# EAGLE design Definitivo (EAGLE 8.0.1)
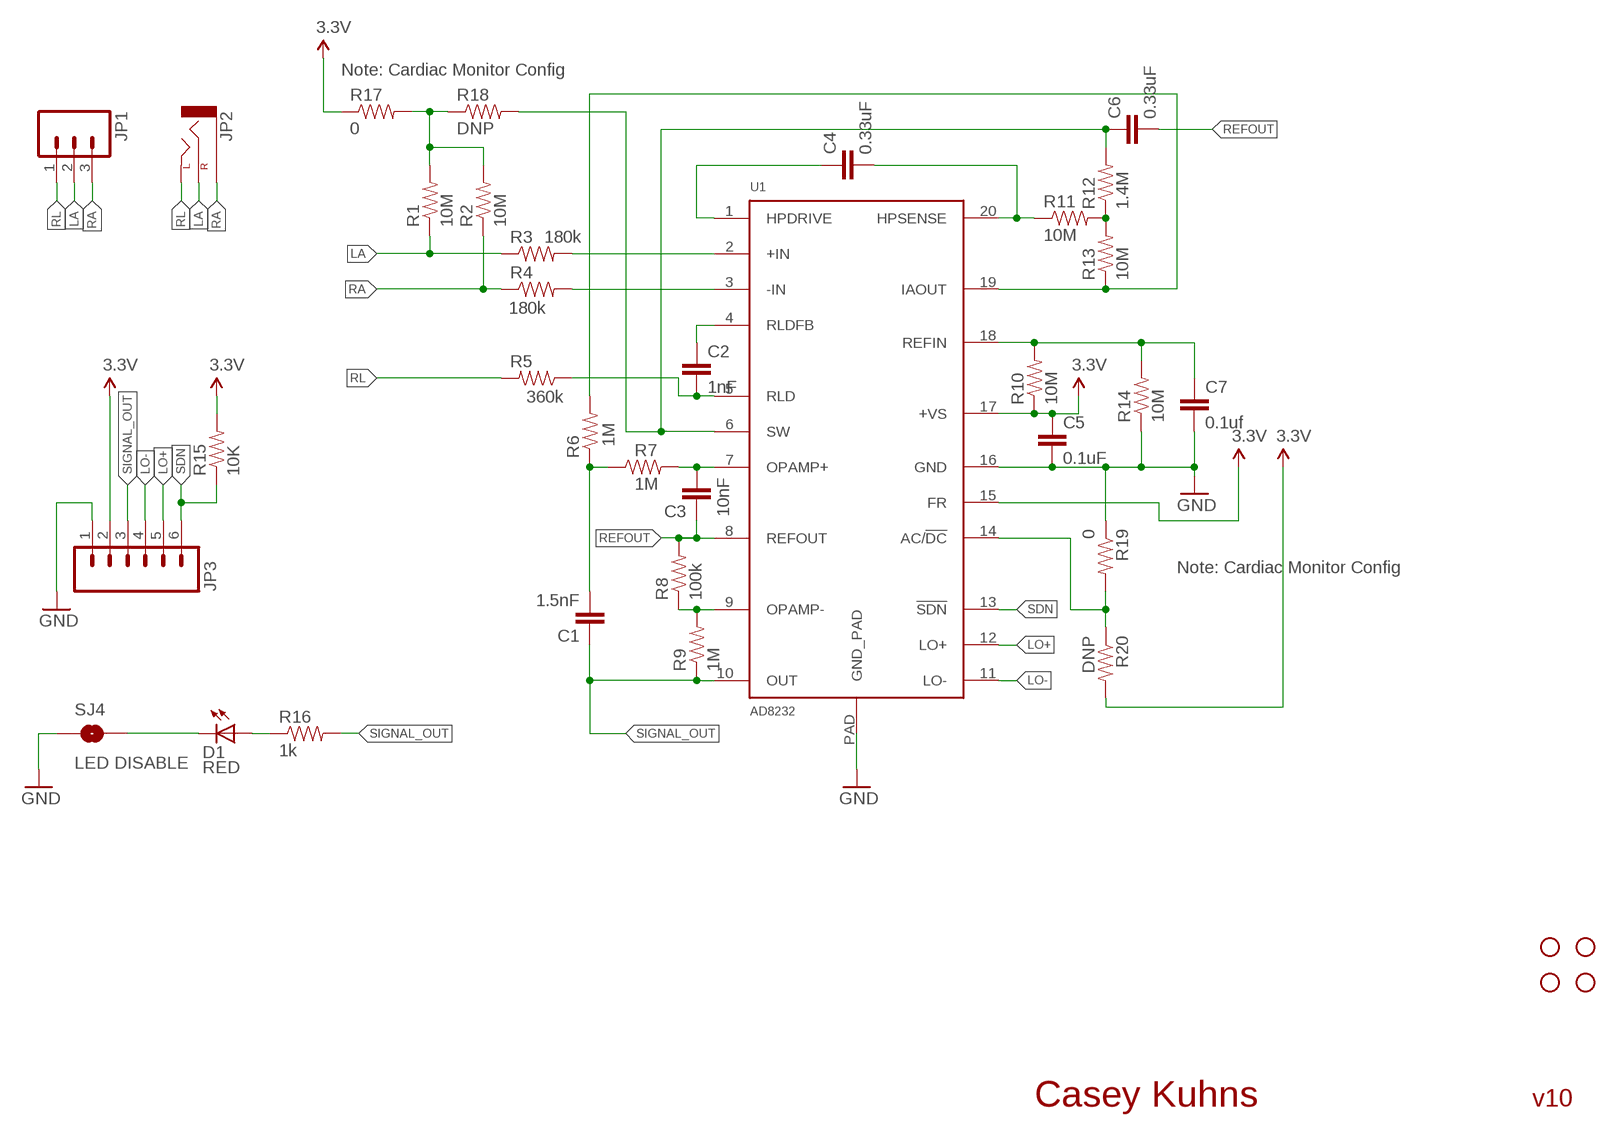
[diagram p0: schematic, sheet 1]

## Parts
C1  1.5nF  CAP0603-CAP  [0603-CAP]
C2  1nF  CAP0603-CAP  [0603-CAP]
C3  10nF  CAP0603-CAP  [0603-CAP]
C4  0.33uF  CAP0805  [0805]
C5  0.1uF  CAP0603-CAP  [0603-CAP]
C6  0.33uF  CAP0805  [0805]
C7  0.1uf  CAP0603-CAP  [0603-CAP]
D1  RED  LED-RED0603  [LED-0603]
JP1  M03PTH  [1X03]
JP2  AUDIO-JACKSMD2  [AUDIO-JACK-3.5MM-SMD]
JP3  M06SIP  [1X06]
R1  10M  RESISTOR0603-RES  [0603-RES]
R2  10M  RESISTOR0603-RES  [0603-RES]
R3  180k  RESISTOR0603-RES  [0603-RES]
R4  180k  RESISTOR0603-RES  [0603-RES]
R5  360k  RESISTOR0603-RES  [0603-RES]
R6  1M  RESISTOR0603-RES  [0603-RES]
R7  1M  RESISTOR0603-RES  [0603-RES]
R8  100k  RESISTOR0603-RES  [0603-RES]
R9  1M  RESISTOR0603-RES  [0603-RES]
R10  10M  RESISTOR0603-RES  [0603-RES]
R11  10M  RESISTOR0603-RES  [0603-RES]
R12  1.4M  RESISTOR0603-RES  [0603-RES]
R13  10M  RESISTOR0603-RES  [0603-RES]
R14  10M  RESISTOR0603-RES  [0603-RES]
R15  10K  10KOHM1/10W1%(0603)0603  [0603-RES]
R16  1k  1K-1%  [0603-RES]
R17  0  0OHM1/10W5%(0603)  [0603]
R18  DNP  0OHM1/10W5%(0603)  [0603]
R19  0  0OHM1/10W5%(0603)  [0603]
R20  DNP  0OHM1/10W5%(0603)  [0603]
SJ4  LED DISABLE  SOLDERJUMPERTRACE  [SJ_2S-TRACE]
STANDOFF1  STAND-OFF  [STAND-OFF]
STANDOFF2  STAND-OFF  [STAND-OFF]
STANDOFF3  STAND-OFF  [STAND-OFF]
STANDOFF4  STAND-OFF  [STAND-OFF]
U1  AD8232  [LFCSP_20]

## Nets
3.3V: C5.1 JP3.2 R10.1 R15.2 R17.1 R20.2 U1.15(FR) U1.17(+VS)
GND: C5.2 C7.2 JP3.1 R14.1 R19.1 SJ4.1 U1.16(GND) U1.PAD(GND_PAD)
LA: JP1.2 JP2.RING(RIGHT) R1.1 R3.1
LO+: JP3.5 U1.12(LO+)
LO-: JP3.4 U1.11(LO-)
N$1: R3.2 U1.2(+IN)
N$2: R4.2 U1.3(-IN)
N$3: C3.2 R7.2 U1.7(OPAMP+)
N$4: C4.2 R11.1 U1.20(HPSENSE)
N$5: C7.1 R10.2 R14.2 U1.18(REFIN)
N$6: D1.A R16.1
N$7: R8.1 R9.2 U1.9(OPAMP-)
N$8: R6.2 R13.1 U1.19(IAOUT)
N$9: C1.2 R6.1 R7.1
N$10: D1.C SJ4.2
N$11: R19.2 R20.1 U1.14(AC/!DC)
N$13: C4.1 U1.1(HPDRIVE)
N$14: R11.2 R12.1 R13.2
N$16: C6.1 R12.2 R18.2 U1.6(SW)
N$17: C2.1 U1.4(RLDFB)
N$18: C2.2 R5.1 U1.5(RLD)
N$20: R1.2 R2.2 R17.2 R18.1
RA: JP1.3 JP2.SLEEVE R2.1 R4.1
REFOUT: C3.1 C6.2 R8.2 U1.8(REFOUT)
RL: JP1.1 JP2.TIP(LEFT) R5.2
SDN: JP3.6 R15.1 U1.13(!SDN)
SIGNAL_OUT: C1.1 JP3.3 R9.1 R16.2 U1.10(OUT)

## Notes on the sheet
- Note: Cardiac Monitor Config
- Note: Cardiac Monitor Config
- Casey Kuhns | v10

## Library data of the parts
C1-C7 = SparkFun-Passives:CAP: Capacitor Standard 0603 ceramic capacitor, and 0.1" leaded capacitor.
D1 = SparkFun-LED:LED-RED: Assorted Red LEDs LilyPad 1206- DIO-09912 1206- DIO-00809 0603- DIO-00819; PROD_ID: DIO-00819
JP1 = SparkFun-Connectors:M03: Header 3 Standard 3-pin 0.1" header. Use with straight break away headers (SKU : PRT-00116), right angle break away headers (PRT-00553), swiss pins (PRT-00743), machine pins (PRT-00117), and female headers (PRT-00115). Molex polarized connector foot print use with SKU : PRT-08232 with associated crimp pins and housings.
JP2 = SparkFun-Connectors:AUDIO-JACK: 3.5mm Audio Jack Simple 3.5mm common PCB mount audio jack. SKU: PRT-08032; PROD_ID: CONN-10353
JP3 = SparkFun-Connectors:M06: Header 6 Standard 6-pin 0.1" header. Use with straight break away headers (SKU : PRT-00116), right angle break away headers (PRT-00553), swiss pins (PRT-00743), machine pins (PRT-00117), and female headers (PRT-00115). Molex polarized connector foot print use with SKU : PRT-08094 with associated crimp pins and housings. NOTES ON THE VARIANTS LOCK and LOCK_LONGPADS... This footprint was designed to help hold the alignment of a through-hole component (i.e. 6-pin header) while soldering it into place. You may notice that each hole has been shifted either up or down by 0.005 of an inch from it's more standard position (which is a perfectly straight line). This slight alteration caused the pins (the squares in the middle) to touch the edges of the holes. Because they are alternating, it causes a "brace" to hold the component in place. 0.005 has proven to be the perfect amount of "off-center" position when using our standard breakaway headers. Although looks a little odd when you look at the bare footprint, once you have a header in there, the alteration is very hard to notice. Also,if you push a header all the way into place, it is covered up entirely on the bottom side. This idea of altering the position of holes to aid alignment will be further integrated into the Sparkfun Library for other footprints. It can help hold any component with 3 or more connection pins.
R1-R14 = SparkFun-Passives:RESISTOR: Resistor Basic schematic elements and footprints for 0603, 1206, and PTH resistors.
R15 = SparkFun-Resistors:10KOHM1/10W1%(0603): RES-00824; PROD_ID: RES-00824
R16 = SparkFun-Resistors:1K-1%: 1k-ohm SMT 1/10W - 1% (0603) RES-07856; PROD_ID: RES-07856
R17 R19 = SparkFun-Resistors:0OHM1/10W5%(0603): RES-08609; PROD_ID: RES-08609
R18 R20 = SparkFun-Resistors:0OHM1/10W5%(0603): RES-08609; PROD_ID: RES-08609; VALUE: 0
SJ4 = SparkFun-Passives:SOLDERJUMPER: Solder Jumper Standard SMD solder jumper. Used to automate production. Two varients : Normally Open and Normally Closed are the same, but have different paste layers. NC will have a large amount of paste and should jumper during reflow.
STANDOFF1-STANDOFF4 = SparkFun-Electromechanical:STAND-OFF: #4 Stand Off This is the mechanical footprint for a #4 phillips button head screw. Use the keepout ring to avoid running the screw head into surrounding components. SKU : PRT-00447
U1 = AD8232:AD8232

## Board
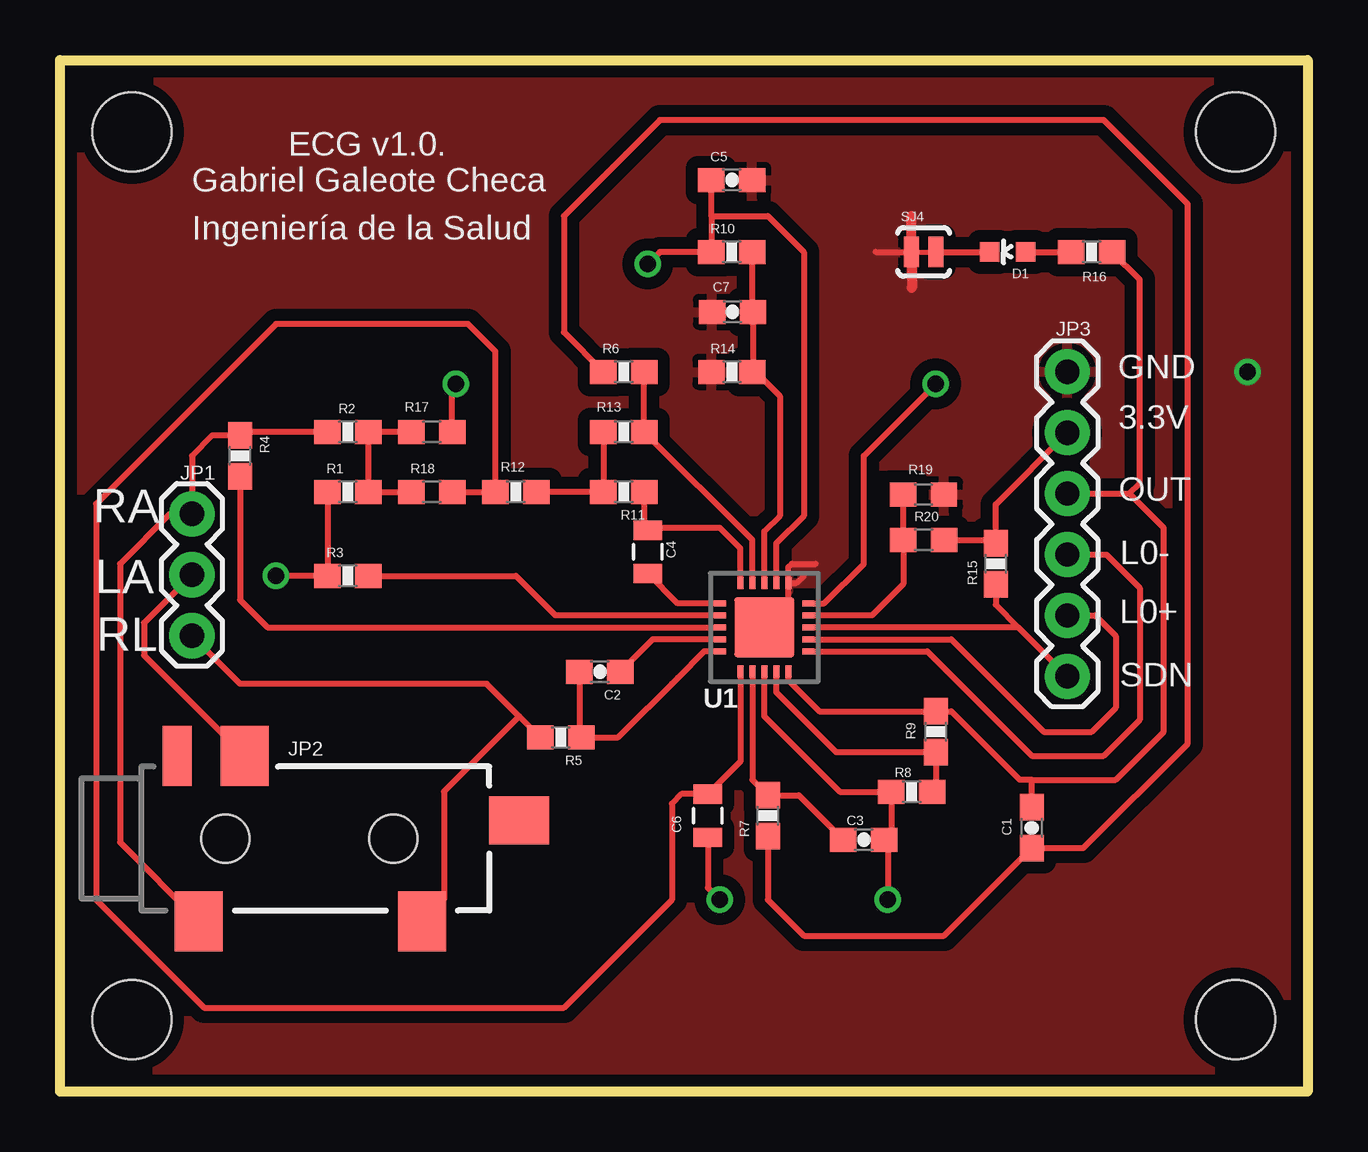
[diagram p1: board, top side]
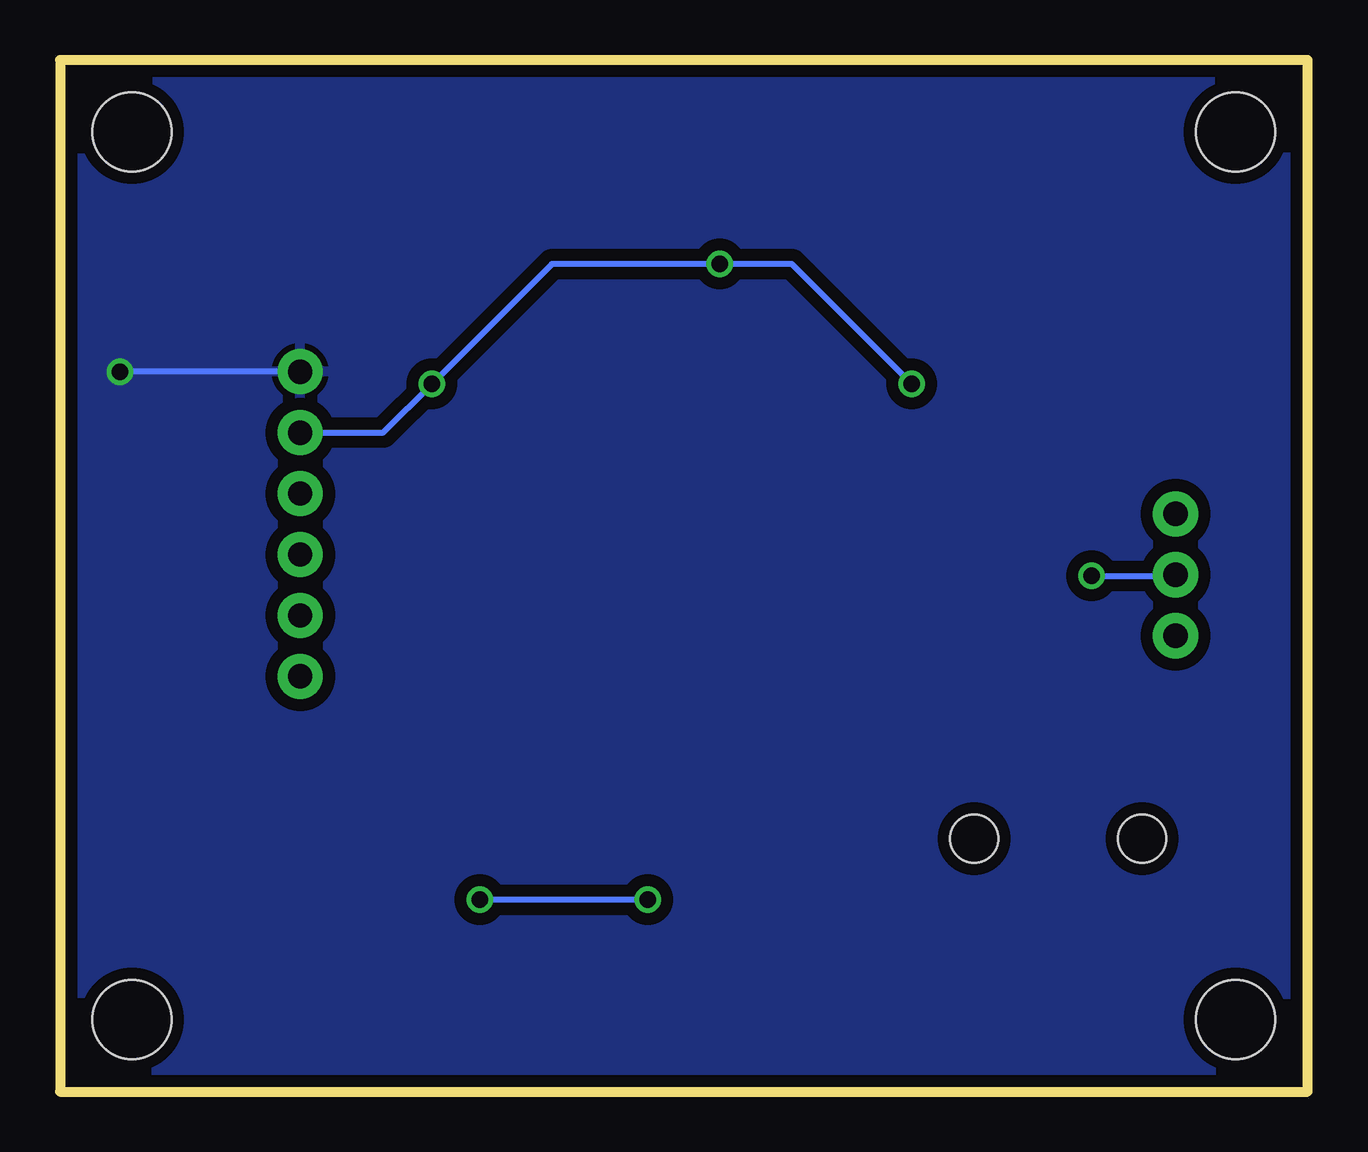
[diagram p2: board, bottom side, seen from below]

Size 52 x 43 mm. Coordinates in mm from the lower left corner, seen from the top.
Outline: 0,43 52,43 52,0 0,0 0,43
Copper layers (1*16): Top 0.035mm / dielectric 1.5mm / Bottom 0.035mm
Design rules "default *": minimum track width 0.24891875mm, minimum drill 24mil, track to track 20mil, track to pad 20mil, pad to pad 20mil, via to via 20mil, smd to smd 20mil, copper to edge 20mil, drill to drill 8mil, minimum pad ring 10mil, minimum via ring 8mil, stop-mask expansion 4mil, vias tented up to drill 0mil, thermal gap 10mil

### Footprints (pad centres in the part's own frame; a part is rotated, then mirrored left to right if it is on the bottom)
0603-CAP = smd 1.1 x 1: 1 -0.85,0; 2 0.85,0
0805 = smd 0.8 x 1.2: 1 -0.9,0; 2 0.9,0
LED-0603 = smd 0.8 x 0.8: A 0,-0.75; C 0,0.75
1X03 = drill 1.016 pad 1.88: 1 0,0; 2 2.54,0; 3 5.08,0
AUDIO-JACK-3.5MM-SMD = smd 2 x 2.5: RING 4.3,3.45; SLEEVE 2.4,-3.45; TIP 11.7,-3.45 | smd 1.2 x 2.5: RSH 1.5,3.45 | smd 2.5 x 2: TSH 15.75,0.75 | hole 2: 3.5,0; 10.5,0
1X06 = drill 1.016 pad 1.88: 1 0,0; 2 2.54,0; 3 5.08,0; 4 7.62,0; 5 10.16,0; 6 12.7,0
0603-RES = smd 1.1 x 1: 1 -0.85,0; 2 0.85,0
0603 = smd 1.1 x 1: 1 -0.85,0; 2 0.85,0
SJ_2S-TRACE = smd 0.635 x 1.27: 1 -0.508,0; 2 0.508,0
STAND-OFF = hole 3.302: 0,0
LFCSP_20 = smd 0.5 x 0.25: 1 -1.85,1; 2 -1.85,0.5; 3 -1.85,0; 4 -1.85,-0.5; 5 -1.85,-1; 11 1.85,-1; 12 1.85,-0.5; 13 1.85,0; 14 1.85,0.5; 15 1.85,1 | smd 0.25 x 0.5: 6 -1,-1.85; 7 -0.5,-1.85; 8 0,-1.85; 9 0.5,-1.85; 10 1,-1.85; 16 1,1.85; 17 0.5,1.85; 18 0,1.85; 19 -0.5,1.85; 20 -1,1.85 | smd 2.5 x 2.5: PAD 0,0

### Placement (x,y rotation side)
C1  40.5,11 270 top
C2  22.5,17.5 180 top
C3  33.5,10.5 180 top
C4  24.5,22.5 90 top
C5  28,38 0 top
C6  27,11.5 270 top
C7  28.03,32.5 180 top
D1  39.5,35 90 top
JP1  5.5,19 90 top
JP2  3.39,10.55 0 top
JP3  41.99,30 270 top
R1  12,25 0 top
R2  12,27.5 0 top
R3  12,21.5 0 top
R4  7.5,26.5 270 top
R5  20.88,14.77 180 top
R6  23.5,30 0 top
R7  29.5,11.5 90 top
R8  35.5,12.5 180 top
R9  36.5,15 270 top
R10  28,35 0 top
R11  23.5,25 180 top
R12  19,25 180 top
R13  23.5,27.5 180 top
R14  28.01,30 0 top
R15  39,22 90 top
R16  43,35 0 top
R17  15.5,27.5 180 top
R18  15.5,25 0 top
R19  36,24.89 180 top
R20  36,23 0 top
SJ4  36,35 0 top
STANDOFF1  3,40 0 top
STANDOFF2  49,40 90 top
STANDOFF3  3,3 0 top
STANDOFF4  49,3 0 top
U1  29.35,19.35 0 top

### Tracks (layer width: path | path; a pad name or v marks a point on that pad's centre or on a via)
3.3V  (via drill 0.7)
  Top 0.254: 42.02,27.5 JP3.2 39,24.48 R15.2 38.85,23 R20.2 | 27.15,36.5 R10.1 25,35 v24.5,34.5 | 27.15,36.5 C5.1 | R17.1 16.35,29.35 v16.5,29.5 | U1.15 31.85,20.35 33.5,22 33.5,26.5 v36.5,29.5 | U1.17 29.85,22.85 31,24 31,35 29.5,36.5 27.15,36.5
  Bottom 0.254: v16.5,29.5 21.5,34.5 v24.5,34.5 31.5,34.5 v36.5,29.5 38.53,27.47 JP3.2
GND  (via drill 0.7)
  Top 0.254: U1.16 30.35,20.35 U1.PAD | U1.16 30.35,21.85 30.5,22 31.5,22 | U1.16 30.7,21.2 31,21.5 | 35.49,36.49 35.5,36.5 | 34,35 SJ4.1
  Top 0.406: 35.49,36.49 SJ4.1 35.5,33.5
  Bottom 0.254: JP3.1 v49.5,30.01 v49.5,30
  pour Bottom: 0.5,42.5 51.5,42.5 51.5,0.5 0.5,0.5
  pour Top: 0.5,42.5 51.5,42.5 51.5,0.5 0.5,0.5
LA  (via drill 0.7)
  Top 0.254: R1.1 R3.1 | 11,21.65 R3.1 | R3.1 v9,21.5 | JP1.2 3.5,19.54 3.5,18.19 JP2.RING
  Bottom 0.254: v9,21.5 5.54,21.5 JP1.2
LO+
  Top 0.254: U1.12 37.15,18.85 41,15 43,15 44,16 44,19 43.16,19.84 JP3.5
LO-
  Top 0.254: U1.11 36.15,18.35 40.5,14 43.5,14 45,15.5 45,21 43.62,22.38 JP3.4
N$1
  Top 0.254: U1.2 20.65,19.85 20.5,20 | 20.5,20 20,20.5 | 20.5,20 19,21.5 R3.2
N$2
  Top 0.254: U1.3 8.65,19.35 7.5,20.5 R4.2
N$3
  Top 0.254: U1.7 28.85,13 R7.2 30.8,12.35 C3.2
N$4
  Top 0.254: U1.20 28.35,22.65 27.5,23.5 24.6,23.5 C4.2 24.35,23.55 R11.1
N$5
  Top 0.254: 28.88,32 C7.1 | 28.88,32 28.88,30.03 R14.2 29,30 30,29 30,24 29.35,23.35 U1.18 | R10.2 28.85,32.03 28.88,32
N$6
  Top 0.254: D1.A R16.1
N$7
  Top 0.254: U1.9 29.85,16.64 32.35,14.15 R9.2 36.5,12.65 R8.1
N$8
  Top 0.254: U1.19 28.85,22.99 R13.1 R6.2
N$9
  Top 0.254: R7.1 29.5,8 31,6.5 36.85,6.5 C1.2 42.65,10.15 47,14.5 47,37 43.5,40.5 25,40.5 21,36.5 21,31.65 R6.1
N$10
  Top 0.254: SJ4.2 D1.C
N$11
  Top 0.254: U1.14 33.85,19.85 35.15,21.15 R20.1 R19.2
N$13
  Top 0.254: C4.1 25.75,20.35 U1.1
N$14
  Top 0.254: R12.1 R11.2 R13.2
N$16
  Top 0.254: R18.2 R12.2 18.15,30.85 17,32 9,32 1.5,24.5 1.5,8 6,3.5 21,3.5 25.5,8 25.5,12 25.9,12.4 C6.1 28.35,13.75 U1.6
N$17
  Top 0.254: U1.4 | U1.4 24.7,18.85 C2.1
N$18
  Top 0.254: U1.5 26.85,18.35 25.75,17.25 | 25.75,17.25 25.5,17 | 25.75,17.25 23.27,14.77 R5.1 21.65,14.84 C2.2
N$20
  Top 0.254: 14.5,25.15 R18.1 R1.2 R2.2 R17.2
RA
  Top 0.254: R2.1 7.65,27.5 R4.1 | 7.27,27.35 R4.1 | R4.1 6.35,27.35 5.5,26.5 JP1.3 4.58,24.08 2.5,22 2.5,10.39 JP2.SLEEVE
REFOUT  (via drill 0.7)
  Top 0.254: U1.8 29.35,15.64 32.5,12.5 R8.2 34.65,10.8 C3.1 34.5,10.5 v34.5,8 | v27.5,8 27,8.5 C6.2
  Bottom 0.254: v27.5,8 v34.5,8
RL
  Top 0.254: JP1.1 7.5,17 17.79,17 19.15,15.65 | 19.15,15.65 R5.2 | 19.15,15.65 16,12.5 16,8.01 JP2.TIP
SDN
  Top 0.254: 39.94,19.35 U1.13 | 39.94,19.35 JP3.6 | R15.1 39,20.29 39.94,19.35
SIGNAL_OUT
  Top 0.254: U1.10 30.35,17.14 31.65,15.85 R9.1 | 36.65,16 R9.1 | R9.1 37.15,15.85 40,13 40.5,13 | 40.5,13 44,13 46,15 46,23.5 44.58,24.92 | JP3.3 44.58,24.92 | 44.58,24.92 45,25.35 45,33.85 R16.2 | C1.1 40.5,13

### Text on the board
tPlace: ECG v1.0. | Gabriel Galeote Checa | Ingeniería de la Salud | GND | 3.3V | OUT | RA | L0- | LA | L0+ | RL | SDN
tNames: JP3 | JP1 | JP2